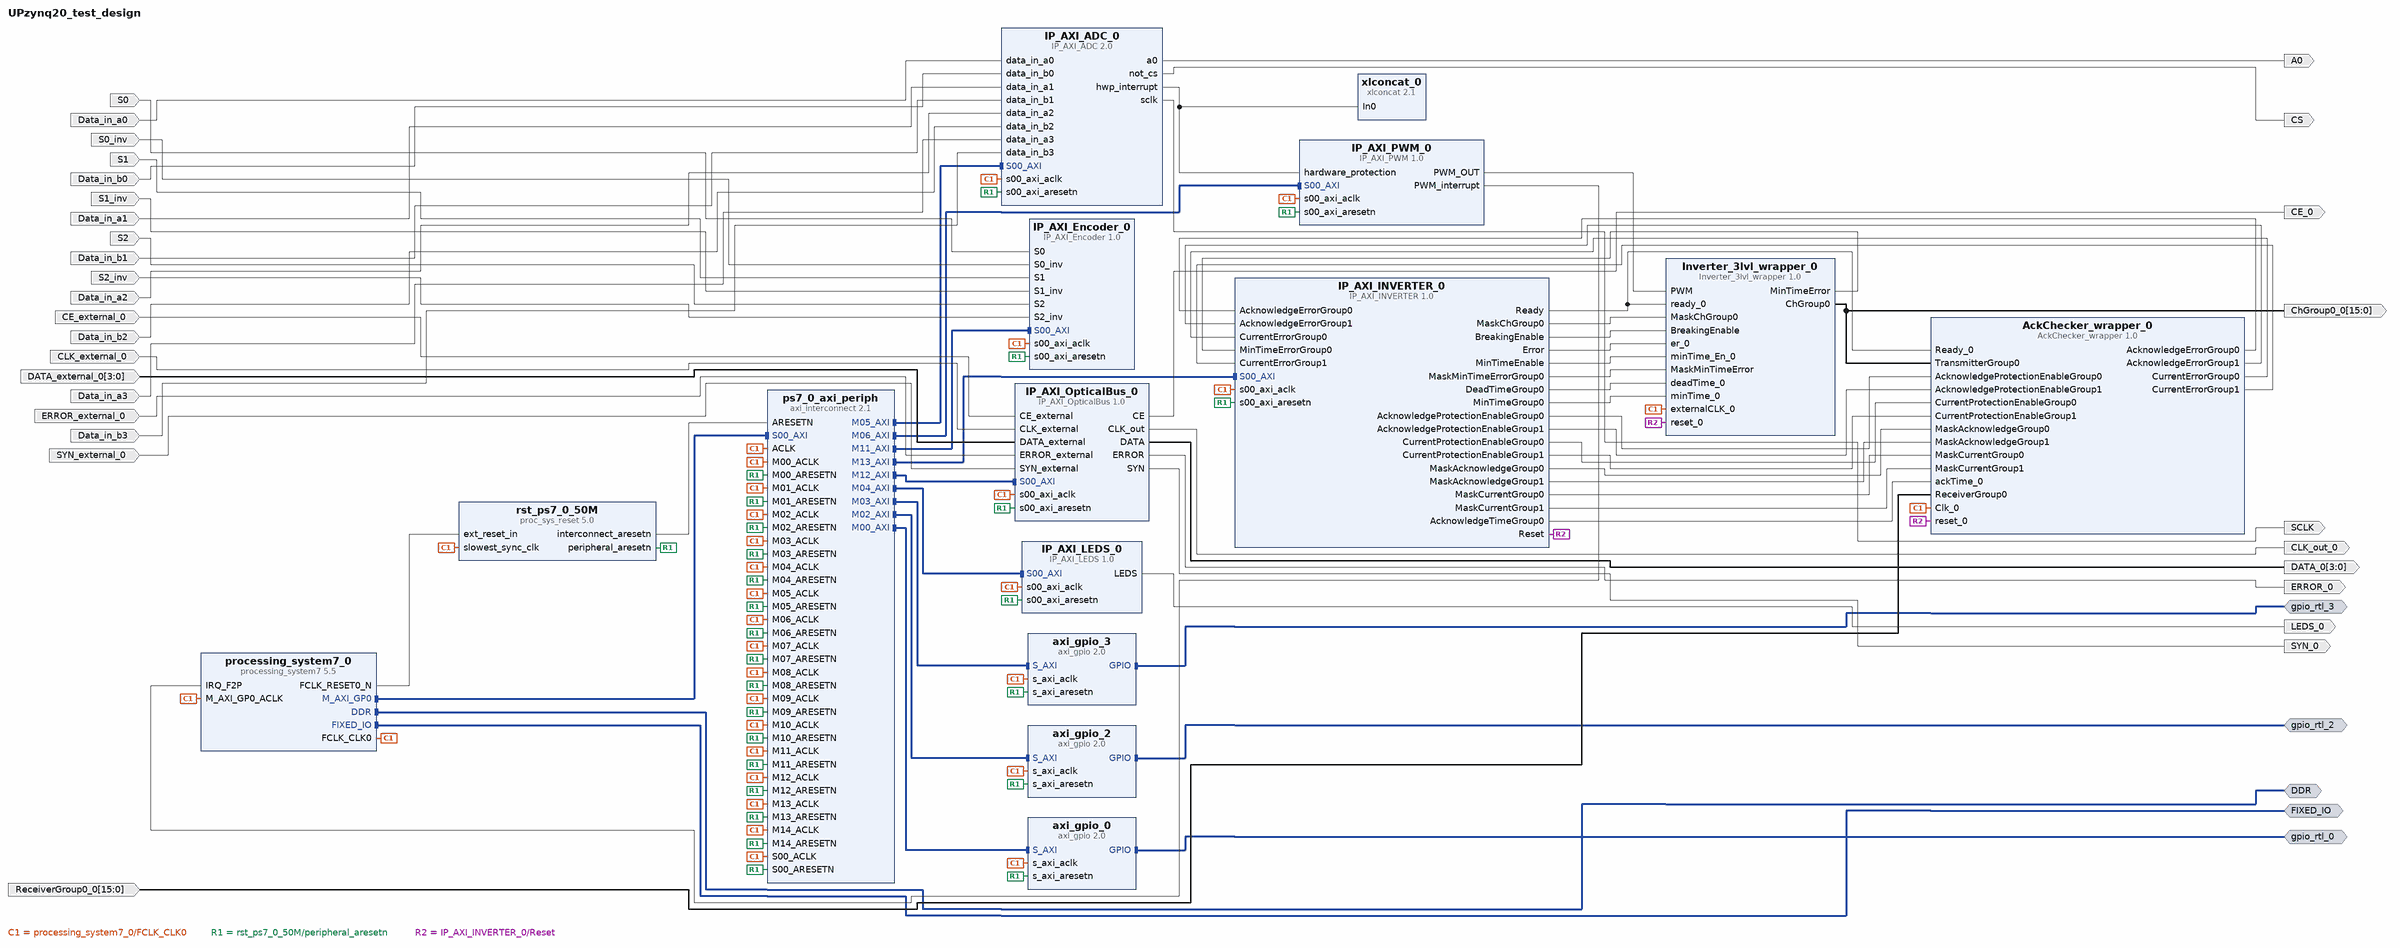
[diagram p0: block diagram of the top level]
# Vivado block design UPzynq20_test_design, xc7z020clg484-3, Vivado 2019.1
create_bd_design UPzynq20_test_design

create_bd_intf_port -mode Master -vlnv xilinx.com:interface:ddrx_rtl:1.0 DDR
create_bd_intf_port -mode Master -vlnv xilinx.com:display_processing_system7:fixedio_rtl:1.0 FIXED_IO
create_bd_intf_port -mode Master -vlnv xilinx.com:interface:gpio_rtl:1.0 gpio_rtl_0
create_bd_intf_port -mode Master -vlnv xilinx.com:interface:gpio_rtl:1.0 gpio_rtl_2
create_bd_intf_port -mode Master -vlnv xilinx.com:interface:gpio_rtl:1.0 gpio_rtl_3
create_bd_port -dir O A0
create_bd_port -dir O CS
create_bd_port -dir O SCLK
create_bd_port -dir I Data_in_a0
create_bd_port -dir I Data_in_b0
create_bd_port -dir I Data_in_a1
create_bd_port -dir I Data_in_b1
create_bd_port -dir I Data_in_a2
create_bd_port -dir I Data_in_b2
create_bd_port -dir I Data_in_a3
create_bd_port -dir I Data_in_b3
create_bd_port -dir O LEDS_0
create_bd_port -dir I S0
create_bd_port -dir I S0_inv
create_bd_port -dir I S1
create_bd_port -dir I S1_inv
create_bd_port -dir I S2
create_bd_port -dir I S2_inv
create_bd_port -dir O CE_0
create_bd_port -dir O -type data CLK_out_0
create_bd_port -dir O -from 3 -to 0 DATA_0
create_bd_port -dir O ERROR_0
create_bd_port -dir O SYN_0
create_bd_port -dir I CE_external_0
create_bd_port -dir I CLK_external_0
create_bd_port -dir I -from 3 -to 0 DATA_external_0
create_bd_port -dir I ERROR_external_0
create_bd_port -dir I SYN_external_0
create_bd_port -dir I -from 15 -to 0 ReceiverGroup0_0
create_bd_port -dir O -from 15 -to 0 ChGroup0_0

create_bd_cell -type ip -vlnv xilinx.com:ip:processing_system7:5.5 processing_system7_0
set_property -dict [list \
  CONFIG.PCW_CAN0_CAN0_IO {MIO 14 .. 15} \
  CONFIG.PCW_CAN0_PERIPHERAL_ENABLE 1 \
  CONFIG.PCW_CAN1_CAN1_IO {MIO 8 .. 9} \
  CONFIG.PCW_CAN1_PERIPHERAL_ENABLE 1 \
  CONFIG.PCW_ENET0_ENET0_IO {MIO 16 .. 27} \
  CONFIG.PCW_ENET0_GRP_MDIO_ENABLE 0 \
  CONFIG.PCW_ENET0_PERIPHERAL_ENABLE 1 \
  CONFIG.PCW_ENET0_RESET_ENABLE 0 \
  CONFIG.PCW_ENET1_ENET1_IO {MIO 28 .. 39} \
  CONFIG.PCW_ENET1_PERIPHERAL_ENABLE 1 \
  CONFIG.PCW_ENET_RESET_ENABLE 1 \
  CONFIG.PCW_ENET_RESET_SELECT {Share reset pin} \
  CONFIG.PCW_GPIO_MIO_GPIO_ENABLE 1 \
  CONFIG.PCW_GPIO_MIO_GPIO_IO MIO \
  CONFIG.PCW_I2C_RESET_ENABLE 1 \
  CONFIG.PCW_IRQ_F2P_INTR 1 \
  CONFIG.PCW_PRESET_BANK1_VOLTAGE {LVCMOS 1.8V} \
  CONFIG.PCW_QSPI_GRP_SINGLE_SS_ENABLE 1 \
  CONFIG.PCW_QSPI_GRP_SINGLE_SS_IO {MIO 1 .. 6} \
  CONFIG.PCW_QSPI_PERIPHERAL_ENABLE 1 \
  CONFIG.PCW_QSPI_QSPI_IO {MIO 1 .. 6} \
  CONFIG.PCW_SD0_GRP_CD_ENABLE 0 \
  CONFIG.PCW_SD0_GRP_WP_ENABLE 0 \
  CONFIG.PCW_SD0_PERIPHERAL_ENABLE 1 \
  CONFIG.PCW_SD0_SD0_IO {MIO 40 .. 45} \
  CONFIG.PCW_SDIO_PERIPHERAL_FREQMHZ 100 \
  CONFIG.PCW_SINGLE_QSPI_DATA_MODE x4 \
  CONFIG.PCW_UART0_PERIPHERAL_ENABLE 1 \
  CONFIG.PCW_UART0_UART0_IO {MIO 10 .. 11} \
  CONFIG.PCW_UART1_PERIPHERAL_ENABLE 1 \
  CONFIG.PCW_UART1_UART1_IO {MIO 52 .. 53} \
  CONFIG.PCW_UART_PERIPHERAL_FREQMHZ 100 \
  CONFIG.PCW_UIPARAM_DDR_PARTNO {MT41K256M16 RE-125} \
  CONFIG.PCW_UIPARAM_GENERATE_SUMMARY NONE \
  CONFIG.PCW_USB0_PERIPHERAL_ENABLE 0 \
  CONFIG.PCW_USB_RESET_ENABLE 1 \
  CONFIG.PCW_USE_FABRIC_INTERRUPT 1 \
] [get_bd_cells processing_system7_0]
# 233 more settings of processing_system7_0 are not shown: defaults, MIO pin electricals, DDR timing, and values the tool derives
create_bd_cell -type ip -vlnv xilinx.com:ip:axi_gpio:2.0 axi_gpio_0
set_property -dict [list \
  CONFIG.C_ALL_OUTPUTS 1 \
  CONFIG.C_DOUT_DEFAULT 0x0000FFFF \
  CONFIG.C_GPIO_WIDTH 16 \
  CONFIG.C_INTERRUPT_PRESENT 1 \
] [get_bd_cells axi_gpio_0]
create_bd_cell -type ip -vlnv xilinx.com:ip:axi_gpio:2.0 axi_gpio_2
set_property -dict {CONFIG.C_ALL_INPUTS 1 CONFIG.C_GPIO_WIDTH 8 CONFIG.C_INTERRUPT_PRESENT 1} [get_bd_cells axi_gpio_2]
create_bd_cell -type ip -vlnv xilinx.com:ip:axi_gpio:2.0 axi_gpio_3
set_property -dict {CONFIG.C_ALL_INPUTS 1 CONFIG.C_GPIO_WIDTH 16 CONFIG.C_INTERRUPT_PRESENT 1} [get_bd_cells axi_gpio_3]
create_bd_cell -type ip -vlnv xilinx.com:ip:axi_interconnect:2.1 ps7_0_axi_periph
set_property -dict {CONFIG.NUM_MI 15} [get_bd_cells ps7_0_axi_periph]
create_bd_cell -type ip -vlnv xilinx.com:ip:proc_sys_reset:5.0 rst_ps7_0_50M
create_bd_cell -type ip -vlnv ssevendenergy.com:user:IP_AXI_LEDS:1.0 IP_AXI_LEDS_0
create_bd_cell -type ip -vlnv ssevendenergy.com:user:IP_AXI_Encoder:1.0 IP_AXI_Encoder_0
create_bd_cell -type ip -vlnv ssevendenergy.com:user:IP_AXI_INVERTER:1.0 IP_AXI_INVERTER_0
create_bd_cell -type ip -vlnv ssevendenergy.com:user:Inverter_3lvl_wrapper:1.0 Inverter_3lvl_wrapper_0
create_bd_cell -type ip -vlnv xilinx.com:ip:xlconcat:2.1 xlconcat_0
create_bd_cell -type ip -vlnv setcorp:user:IP_AXI_OpticalBus:1.0 IP_AXI_OpticalBus_0
create_bd_cell -type ip -vlnv setcorp:user:IP_AXI_PWM:1.0 IP_AXI_PWM_0
create_bd_cell -type ip -vlnv ssevendenergy.com:user:AckChecker_wrapper:1.0 AckChecker_wrapper_0
create_bd_cell -type ip -vlnv setcorp:user:IP_AXI_ADC:2.0 IP_AXI_ADC_0

# ---- connections ----

connect_bd_intf_net [get_bd_intf_ports gpio_rtl_3] [get_bd_intf_pins axi_gpio_3/GPIO]
connect_bd_intf_net [get_bd_intf_pins processing_system7_0/M_AXI_GP0] [get_bd_intf_pins ps7_0_axi_periph/S00_AXI]
connect_bd_intf_net [get_bd_intf_pins ps7_0_axi_periph/M11_AXI] [get_bd_intf_pins IP_AXI_Encoder_0/S00_AXI]
connect_bd_intf_net [get_bd_intf_pins ps7_0_axi_periph/M04_AXI] [get_bd_intf_pins IP_AXI_LEDS_0/S00_AXI]
connect_bd_intf_net [get_bd_intf_pins ps7_0_axi_periph/M13_AXI] [get_bd_intf_pins IP_AXI_INVERTER_0/S00_AXI]
connect_bd_intf_net [get_bd_intf_pins ps7_0_axi_periph/M12_AXI] [get_bd_intf_pins IP_AXI_OpticalBus_0/S00_AXI]
connect_bd_intf_net [get_bd_intf_pins ps7_0_axi_periph/M05_AXI] [get_bd_intf_pins IP_AXI_ADC_0/S00_AXI]
connect_bd_intf_net [get_bd_intf_ports DDR] [get_bd_intf_pins processing_system7_0/DDR]
connect_bd_intf_net [get_bd_intf_ports gpio_rtl_2] [get_bd_intf_pins axi_gpio_2/GPIO]
connect_bd_intf_net [get_bd_intf_pins ps7_0_axi_periph/M06_AXI] [get_bd_intf_pins IP_AXI_PWM_0/S00_AXI]
connect_bd_intf_net [get_bd_intf_pins ps7_0_axi_periph/M03_AXI] [get_bd_intf_pins axi_gpio_3/S_AXI]
connect_bd_intf_net [get_bd_intf_ports FIXED_IO] [get_bd_intf_pins processing_system7_0/FIXED_IO]
connect_bd_intf_net [get_bd_intf_pins ps7_0_axi_periph/M02_AXI] [get_bd_intf_pins axi_gpio_2/S_AXI]
connect_bd_intf_net [get_bd_intf_pins ps7_0_axi_periph/M00_AXI] [get_bd_intf_pins axi_gpio_0/S_AXI]
connect_bd_intf_net [get_bd_intf_ports gpio_rtl_0] [get_bd_intf_pins axi_gpio_0/GPIO]
connect_bd_net [get_bd_pins processing_system7_0/FCLK_CLK0] \
  [get_bd_pins processing_system7_0/M_AXI_GP0_ACLK] [get_bd_pins ps7_0_axi_periph/S00_ACLK] \
  [get_bd_pins rst_ps7_0_50M/slowest_sync_clk] [get_bd_pins axi_gpio_0/s_axi_aclk] [get_bd_pins ps7_0_axi_periph/M00_ACLK] \
  [get_bd_pins ps7_0_axi_periph/ACLK] [get_bd_pins ps7_0_axi_periph/M01_ACLK] [get_bd_pins axi_gpio_2/s_axi_aclk] \
  [get_bd_pins ps7_0_axi_periph/M02_ACLK] [get_bd_pins axi_gpio_3/s_axi_aclk] [get_bd_pins ps7_0_axi_periph/M03_ACLK] \
  [get_bd_pins ps7_0_axi_periph/M04_ACLK] [get_bd_pins ps7_0_axi_periph/M05_ACLK] [get_bd_pins ps7_0_axi_periph/M06_ACLK] \
  [get_bd_pins IP_AXI_LEDS_0/s00_axi_aclk] [get_bd_pins ps7_0_axi_periph/M07_ACLK] [get_bd_pins ps7_0_axi_periph/M08_ACLK] \
  [get_bd_pins ps7_0_axi_periph/M09_ACLK] [get_bd_pins ps7_0_axi_periph/M10_ACLK] [get_bd_pins ps7_0_axi_periph/M11_ACLK] \
  [get_bd_pins IP_AXI_Encoder_0/s00_axi_aclk] [get_bd_pins ps7_0_axi_periph/M12_ACLK] [get_bd_pins ps7_0_axi_periph/M13_ACLK] \
  [get_bd_pins ps7_0_axi_periph/M14_ACLK] [get_bd_pins IP_AXI_INVERTER_0/s00_axi_aclk] \
  [get_bd_pins Inverter_3lvl_wrapper_0/externalCLK_0] [get_bd_pins IP_AXI_OpticalBus_0/s00_axi_aclk] \
  [get_bd_pins IP_AXI_PWM_0/s00_axi_aclk] [get_bd_pins AckChecker_wrapper_0/Clk_0] [get_bd_pins IP_AXI_ADC_0/s00_axi_aclk]
connect_bd_net [get_bd_pins processing_system7_0/FCLK_RESET0_N] [get_bd_pins rst_ps7_0_50M/ext_reset_in]
connect_bd_net [get_bd_pins rst_ps7_0_50M/peripheral_aresetn] \
  [get_bd_pins ps7_0_axi_periph/S00_ARESETN] [get_bd_pins axi_gpio_0/s_axi_aresetn] \
  [get_bd_pins ps7_0_axi_periph/M00_ARESETN] [get_bd_pins ps7_0_axi_periph/M01_ARESETN] \
  [get_bd_pins axi_gpio_2/s_axi_aresetn] [get_bd_pins ps7_0_axi_periph/M02_ARESETN] [get_bd_pins axi_gpio_3/s_axi_aresetn] \
  [get_bd_pins ps7_0_axi_periph/M03_ARESETN] [get_bd_pins ps7_0_axi_periph/M04_ARESETN] \
  [get_bd_pins ps7_0_axi_periph/M05_ARESETN] [get_bd_pins ps7_0_axi_periph/M06_ARESETN] \
  [get_bd_pins IP_AXI_LEDS_0/s00_axi_aresetn] [get_bd_pins ps7_0_axi_periph/M07_ARESETN] \
  [get_bd_pins ps7_0_axi_periph/M08_ARESETN] [get_bd_pins ps7_0_axi_periph/M09_ARESETN] \
  [get_bd_pins ps7_0_axi_periph/M10_ARESETN] [get_bd_pins ps7_0_axi_periph/M11_ARESETN] \
  [get_bd_pins IP_AXI_Encoder_0/s00_axi_aresetn] [get_bd_pins ps7_0_axi_periph/M12_ARESETN] \
  [get_bd_pins ps7_0_axi_periph/M13_ARESETN] [get_bd_pins ps7_0_axi_periph/M14_ARESETN] \
  [get_bd_pins IP_AXI_INVERTER_0/s00_axi_aresetn] [get_bd_pins IP_AXI_OpticalBus_0/s00_axi_aresetn] \
  [get_bd_pins IP_AXI_PWM_0/s00_axi_aresetn] [get_bd_pins IP_AXI_ADC_0/s00_axi_aresetn]
connect_bd_net [get_bd_pins IP_AXI_LEDS_0/LEDS] [get_bd_ports LEDS_0]
connect_bd_net [get_bd_pins rst_ps7_0_50M/interconnect_aresetn] [get_bd_pins ps7_0_axi_periph/ARESETN]
connect_bd_net -net S0_0_1 [get_bd_ports S0] [get_bd_pins IP_AXI_Encoder_0/S0]
connect_bd_net -net S0_inv_0_1 [get_bd_ports S0_inv] [get_bd_pins IP_AXI_Encoder_0/S0_inv]
connect_bd_net -net S1_0_1 [get_bd_ports S1] [get_bd_pins IP_AXI_Encoder_0/S1]
connect_bd_net -net S1_inv_0_1 [get_bd_ports S1_inv] [get_bd_pins IP_AXI_Encoder_0/S1_inv]
connect_bd_net -net S2_0_1 [get_bd_ports S2] [get_bd_pins IP_AXI_Encoder_0/S2]
connect_bd_net -net S2_inv_0_1 [get_bd_ports S2_inv] [get_bd_pins IP_AXI_Encoder_0/S2_inv]
connect_bd_net [get_bd_pins IP_AXI_OpticalBus_0/CE] [get_bd_ports CE_0]
connect_bd_net [get_bd_pins IP_AXI_OpticalBus_0/CLK_out] [get_bd_ports CLK_out_0]
connect_bd_net [get_bd_pins IP_AXI_OpticalBus_0/DATA] [get_bd_ports DATA_0]
connect_bd_net [get_bd_pins IP_AXI_OpticalBus_0/ERROR] [get_bd_ports ERROR_0]
connect_bd_net [get_bd_pins IP_AXI_OpticalBus_0/SYN] [get_bd_ports SYN_0]
connect_bd_net -net CE_external_0_1 [get_bd_ports CE_external_0] [get_bd_pins IP_AXI_OpticalBus_0/CE_external]
connect_bd_net -net CLK_external_0_1 [get_bd_ports CLK_external_0] [get_bd_pins IP_AXI_OpticalBus_0/CLK_external]
connect_bd_net -net DATA_external_0_1 [get_bd_ports DATA_external_0] [get_bd_pins IP_AXI_OpticalBus_0/DATA_external]
connect_bd_net -net ERROR_external_0_1 [get_bd_ports ERROR_external_0] [get_bd_pins IP_AXI_OpticalBus_0/ERROR_external]
connect_bd_net -net SYN_external_0_1 [get_bd_ports SYN_external_0] [get_bd_pins IP_AXI_OpticalBus_0/SYN_external]
connect_bd_net -net ReceiverGroup0_0_1 [get_bd_ports ReceiverGroup0_0] [get_bd_pins AckChecker_wrapper_0/ReceiverGroup0]
connect_bd_net [get_bd_pins IP_AXI_INVERTER_0/Reset] [get_bd_pins Inverter_3lvl_wrapper_0/reset_0] [get_bd_pins AckChecker_wrapper_0/reset_0]
connect_bd_net [get_bd_pins IP_AXI_INVERTER_0/Ready] [get_bd_pins Inverter_3lvl_wrapper_0/ready_0] [get_bd_pins AckChecker_wrapper_0/Ready_0]
connect_bd_net [get_bd_pins AckChecker_wrapper_0/AcknowledgeErrorGroup0] [get_bd_pins IP_AXI_INVERTER_0/AcknowledgeErrorGroup0]
connect_bd_net [get_bd_pins AckChecker_wrapper_0/AcknowledgeErrorGroup1] [get_bd_pins IP_AXI_INVERTER_0/AcknowledgeErrorGroup1]
connect_bd_net [get_bd_pins AckChecker_wrapper_0/CurrentErrorGroup0] [get_bd_pins IP_AXI_INVERTER_0/CurrentErrorGroup0]
connect_bd_net [get_bd_pins AckChecker_wrapper_0/CurrentErrorGroup1] [get_bd_pins IP_AXI_INVERTER_0/CurrentErrorGroup1]
connect_bd_net [get_bd_pins IP_AXI_INVERTER_0/AcknowledgeProtectionEnableGroup0] [get_bd_pins AckChecker_wrapper_0/AcknowledgeProtectionEnableGroup0]
connect_bd_net [get_bd_pins IP_AXI_INVERTER_0/AcknowledgeProtectionEnableGroup1] [get_bd_pins AckChecker_wrapper_0/AcknowledgeProtectionEnableGroup1]
connect_bd_net [get_bd_pins IP_AXI_INVERTER_0/CurrentProtectionEnableGroup0] [get_bd_pins AckChecker_wrapper_0/CurrentProtectionEnableGroup0]
connect_bd_net [get_bd_pins IP_AXI_INVERTER_0/CurrentProtectionEnableGroup1] [get_bd_pins AckChecker_wrapper_0/CurrentProtectionEnableGroup1]
connect_bd_net [get_bd_pins IP_AXI_INVERTER_0/MaskAcknowledgeGroup0] [get_bd_pins AckChecker_wrapper_0/MaskAcknowledgeGroup0]
connect_bd_net [get_bd_pins IP_AXI_INVERTER_0/MaskAcknowledgeGroup1] [get_bd_pins AckChecker_wrapper_0/MaskAcknowledgeGroup1]
connect_bd_net [get_bd_pins IP_AXI_INVERTER_0/MaskCurrentGroup0] [get_bd_pins AckChecker_wrapper_0/MaskCurrentGroup0]
connect_bd_net [get_bd_pins IP_AXI_INVERTER_0/MaskCurrentGroup1] [get_bd_pins AckChecker_wrapper_0/MaskCurrentGroup1]
connect_bd_net [get_bd_pins IP_AXI_INVERTER_0/AcknowledgeTimeGroup0] [get_bd_pins AckChecker_wrapper_0/ackTime_0]
connect_bd_net [get_bd_pins Inverter_3lvl_wrapper_0/ChGroup0] [get_bd_ports ChGroup0_0] [get_bd_pins AckChecker_wrapper_0/TransmitterGroup0]
connect_bd_net [get_bd_pins Inverter_3lvl_wrapper_0/MinTimeError] [get_bd_pins IP_AXI_INVERTER_0/MinTimeErrorGroup0]
connect_bd_net [get_bd_pins IP_AXI_INVERTER_0/MaskChGroup0] [get_bd_pins Inverter_3lvl_wrapper_0/MaskChGroup0]
connect_bd_net [get_bd_pins IP_AXI_INVERTER_0/BreakingEnable] [get_bd_pins Inverter_3lvl_wrapper_0/BreakingEnable]
connect_bd_net [get_bd_pins IP_AXI_INVERTER_0/Error] [get_bd_pins Inverter_3lvl_wrapper_0/er_0]
connect_bd_net [get_bd_pins IP_AXI_INVERTER_0/MinTimeEnable] [get_bd_pins Inverter_3lvl_wrapper_0/minTime_En_0]
connect_bd_net [get_bd_pins IP_AXI_PWM_0/PWM_OUT] [get_bd_pins Inverter_3lvl_wrapper_0/PWM]
connect_bd_net [get_bd_pins IP_AXI_INVERTER_0/MaskMinTimeErrorGroup0] [get_bd_pins Inverter_3lvl_wrapper_0/MaskMinTimeError]
connect_bd_net [get_bd_pins IP_AXI_INVERTER_0/DeadTimeGroup0] [get_bd_pins Inverter_3lvl_wrapper_0/deadTime_0]
connect_bd_net [get_bd_pins IP_AXI_INVERTER_0/MinTimeGroup0] [get_bd_pins Inverter_3lvl_wrapper_0/minTime_0]
connect_bd_net [get_bd_pins IP_AXI_ADC_0/sclk] [get_bd_ports SCLK]
connect_bd_net [get_bd_pins IP_AXI_ADC_0/a0] [get_bd_ports A0]
connect_bd_net -net Data_in_a0_1 [get_bd_ports Data_in_a0] [get_bd_pins IP_AXI_ADC_0/data_in_a0]
connect_bd_net -net Data_in_b0_1 [get_bd_ports Data_in_b0] [get_bd_pins IP_AXI_ADC_0/data_in_b0]
connect_bd_net -net Data_in_a1_1 [get_bd_ports Data_in_a1] [get_bd_pins IP_AXI_ADC_0/data_in_a1]
connect_bd_net -net Data_in_b1_1 [get_bd_ports Data_in_b1] [get_bd_pins IP_AXI_ADC_0/data_in_b1]
connect_bd_net -net Data_in_a2_1 [get_bd_ports Data_in_a2] [get_bd_pins IP_AXI_ADC_0/data_in_a2]
connect_bd_net -net Data_in_b2_1 [get_bd_ports Data_in_b2] [get_bd_pins IP_AXI_ADC_0/data_in_b2]
connect_bd_net -net Data_in_a3_1 [get_bd_ports Data_in_a3] [get_bd_pins IP_AXI_ADC_0/data_in_a3]
connect_bd_net -net Data_in_b3_1 [get_bd_ports Data_in_b3] [get_bd_pins IP_AXI_ADC_0/data_in_b3]
connect_bd_net [get_bd_pins IP_AXI_PWM_0/PWM_interrupt] [get_bd_pins processing_system7_0/IRQ_F2P]
connect_bd_net [get_bd_pins IP_AXI_ADC_0/hwp_interrupt] [get_bd_pins IP_AXI_PWM_0/hardware_protection] [get_bd_pins xlconcat_0/In0]
connect_bd_net [get_bd_pins IP_AXI_ADC_0/not_cs] [get_bd_ports CS]

# ---- address map ----
assign_bd_address -offset 0x41200000 -range 64K -target_address_space [get_bd_addr_spaces processing_system7_0/Data] [get_bd_addr_segs axi_gpio_0/S_AXI/Reg]
assign_bd_address -offset 0x41220000 -range 64K -target_address_space [get_bd_addr_spaces processing_system7_0/Data] [get_bd_addr_segs axi_gpio_2/S_AXI/Reg]
assign_bd_address -offset 0x41230000 -range 64K -target_address_space [get_bd_addr_spaces processing_system7_0/Data] [get_bd_addr_segs axi_gpio_3/S_AXI/Reg]
assign_bd_address -offset 0x43C00000 -range 64K -target_address_space [get_bd_addr_spaces processing_system7_0/Data] [get_bd_addr_segs IP_AXI_LEDS_0/S00_AXI/S00_AXI_reg]
assign_bd_address -offset 0x43C10000 -range 64K -target_address_space [get_bd_addr_spaces processing_system7_0/Data] [get_bd_addr_segs IP_AXI_ADC_0/S00_AXI/S00_AXI_reg]
assign_bd_address -offset 0x43C20000 -range 64K -target_address_space [get_bd_addr_spaces processing_system7_0/Data] [get_bd_addr_segs IP_AXI_PWM_0/S00_AXI/S00_AXI_reg]
assign_bd_address -offset 0x43C30000 -range 64K -target_address_space [get_bd_addr_spaces processing_system7_0/Data] [get_bd_addr_segs IP_AXI_Encoder_0/S00_AXI/S00_AXI_reg]
assign_bd_address -offset 0x43C40000 -range 64K -target_address_space [get_bd_addr_spaces processing_system7_0/Data] [get_bd_addr_segs IP_AXI_OpticalBus_0/S00_AXI/S00_AXI_reg]
assign_bd_address -offset 0x43C50000 -range 64K -target_address_space [get_bd_addr_spaces processing_system7_0/Data] [get_bd_addr_segs IP_AXI_INVERTER_0/S00_AXI/S00_AXI_reg]

validate_bd_design
save_bd_design
